# Altium schematic sheet Transceiver.SchDoc
size A4; SheetNumber: 2; SheetTotal: 8
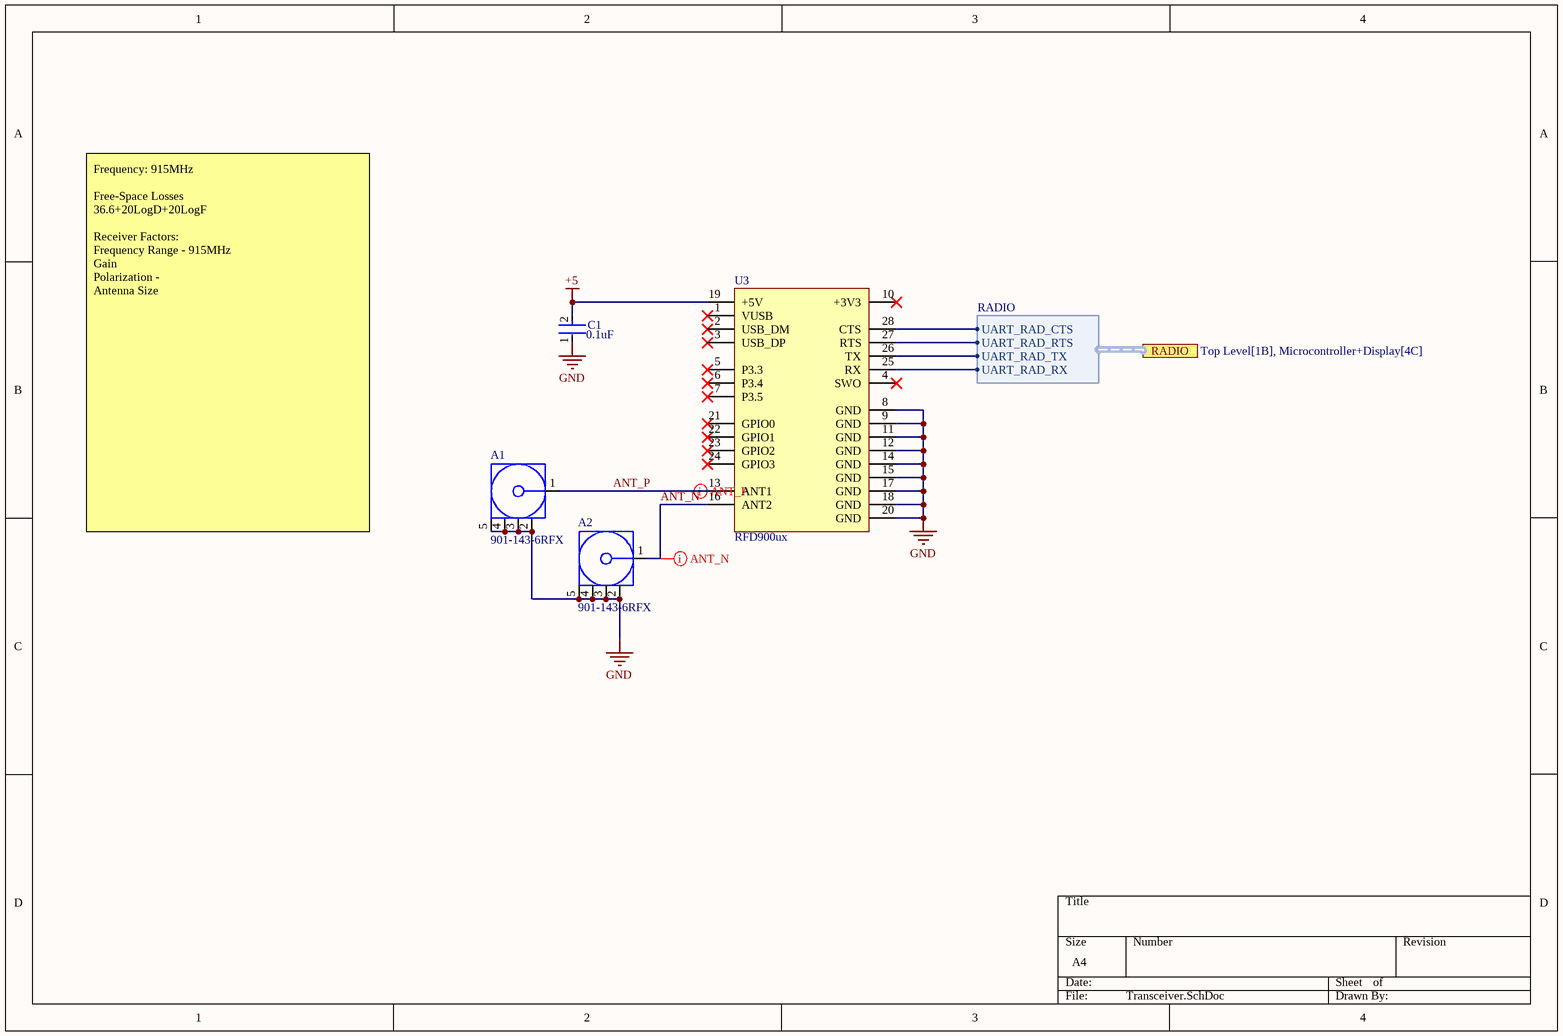
[diagram p0: Transceiver.SchDoc]

## Parts
A1  901-143-6RFX  [903-143-6RFX]
A2  901-143-6RFX  [903-143-6RFX]
C1  Capacitance: 0.1uF  [FP-C1608-080-0_1-MFG]  (hidden comment: C1608X5R1A106K080AC)
U3  RFD900ux  [RFD900UX]

## Ports
RADIO (harness RADIO, see Top Level[1B], Microcontroller+Display[4C])

## Harnesses
RADIO: UART_RAD_CTS, UART_RAD_RTS, UART_RAD_TX, UART_RAD_RX

## Nets
+5: C1.2 U3.19(+5V)
GND: A1.2 A1.3 A1.4 A1.5 A2.2 A2.3 A2.4 A2.5 C1.1 U3.8(GND) U3.9(GND) U3.11(GND) U3.12(GND) U3.14(GND) U3.15(GND) U3.17(GND) U3.18(GND) U3.20(GND)
ANT_N: A2.1 U3.16(ANT2)
ANT_P: A1.1 U3.13(ANT1)
NetU3_25: U3.25(RX) ; port RADIO.UART_RAD_RX
NetU3_26: U3.26(TX) ; port RADIO.UART_RAD_TX
NetU3_27: U3.27(RTS) ; port RADIO.UART_RAD_RTS
NetU3_28: U3.28(CTS) ; port RADIO.UART_RAD_CTS

Not connected (* = marked no-connect by the designer): U3 1(VUSB)* 2(USB_DM)* 3(USB_DP)* 4(SWO)* 5(P3.3)* 6(P3.4)* 7(P3.5)* 10(+3V3)* 21(GPIO0)* 22(GPIO1)* 23(GPIO2)* 24(GPIO3)*

## Layout directives
differential pair: ANT_N, ANT_P

## Notes on the sheet
- Frequency: 915MHz
  Free-Space Losses
  36.6+20LogD+20LogF
  Receiver Factors:
  Frequency Range - 915MHz
  Gain
  Polarization -
  Antenna Size

## Library data of the parts
C1 = CMP-2000-04979-3: Multilayer Ceramic Capacitors 10μF ±10% 10V X5R SMD 0603; Dielectric Material: Ceramic; Construction: Flat; Height: 0.8mm; Thickness: 0.035inch; Case Code (Metric): 1608; Radiation Hardening: No; Number of Pins: 2; Voltage Rating (DC): 10V; Depth: 0.8mm; Voltage: 10V; RoHS Compliant: Yes; Voltage Rating: 10V; Package Quantity: 1; Resistor Type: Ceramic; Termination: SMD/SMT; Lead Free: Lead Free; REACH SVHC: No SVHC; Tolerance: 10%; Mount: Surface Mount; Series: C; Packaging: Tape and Reel; Width: 0.8mm; Dielectric: X5R; Weight: 7.1E-05oz; Length: 1.6mm; Max Operating Temperature: 85°C; Case Code (Imperial): 0603; Case/Package: 0603; Min Operating Temperature: -55°C